# Altium schematic sheet MI.SchDoc
size A3
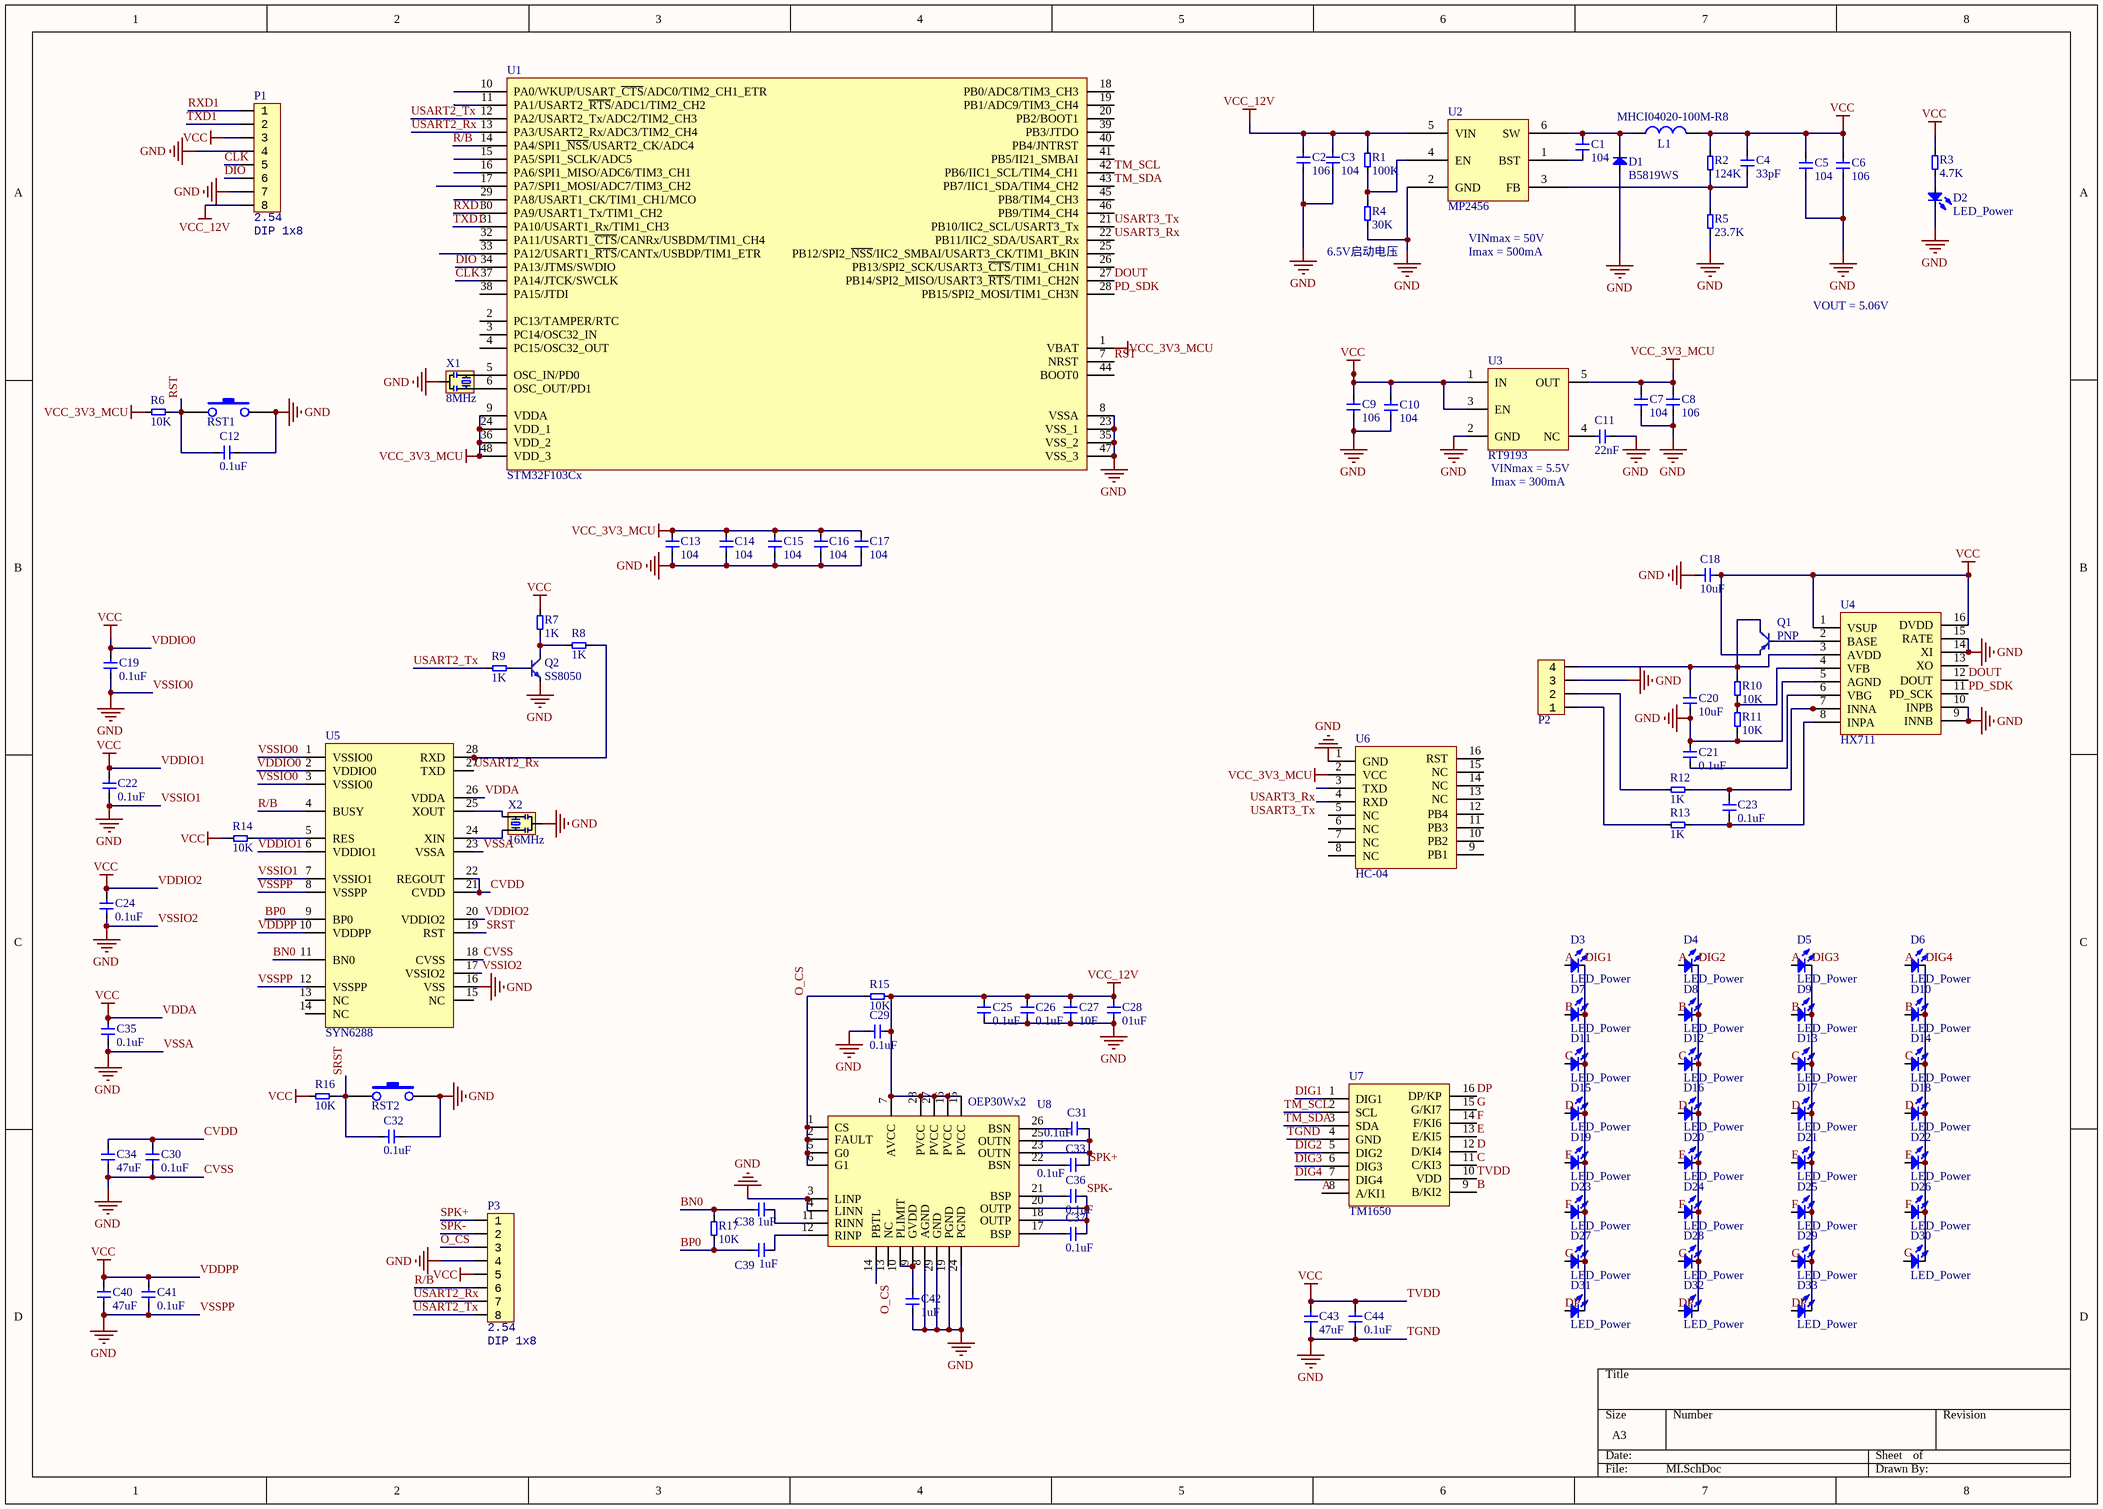
[diagram p0: MI.SchDoc]

## Parts
C1  104  [CAP-0603-L]
C2  106  [CAP-0603-L]
C3  104  [CAP-0603-L]
C4  33pF  [CAP-0603-L]
C5  104  [CAP-0603-L]
C6  106  [CAP-0603-L]
C7  104  [CAP-0603-L]
C8  106  [CAP-0603-L]
C9  106  [CAP-0603-L]
C10  104  [CAP-0603-L]
C11  22nF  [CAP-0603-L]
C12  0.1uF  [CAP-0603-L]
C13  104  [CAP-0603-L]
C14  104  [CAP-0603-L]
C15  104  [CAP-0603-L]
C16  104  [CAP-0603-L]
C17  104  [CAP-0603-L]
C18  10uF  [CAP-0603-L]
C19  0.1uF  [CAP-0603-L]
C20  10uF  [CAP-0603-L]
C21  0.1uF  [CAP-0603-L]
C22  0.1uF  [CAP-0603-L]
C23  0.1uF  [CAP-0603-L]
C24  0.1uF  [CAP-0603-L]
C25  0.1uF  [CAP-0603-L]
C26  0.1uF  [CAP-0603-L]
C27  10F  [CAP-0603-L]
C28  01uF  [CAP-0603-L]
C29  0.1uF  [CAP-0603-L]
C30  0.1uF  [CAP-0603-L]
C31  0.1uF  [CAP-0603-L]
C32  0.1uF  [CAP-0603-L]
C33  0.1uF  [CAP-0603-L]
C34  47uF  [CAP-0603-L]
C35  0.1uF  [CAP-0603-L]
C36  0.1uF  [CAP-0603-L]
C37  0.1uF  [CAP-0603-L]
C38  1uF  [CAP-0603-L]
C39  1uF  [CAP-0603-L]
C40  47uF  [CAP-0603-L]
C41  0.1uF  [CAP-0603-L]
C42  1uF  [CAP-0603-L]
C43  47uF  [CAP-0603-L]
C44  0.1uF  [CAP-0603-L]
D1  B5819WS  [SOD_323]
D2  LED_Power  [LED_0603-L]
D3  LED_Power  [LED_0603-L]
D4  LED_Power  [LED_0603-L]
D5  LED_Power  [LED_0603-L]
D6  LED_Power  [LED_0603-L]
D7  LED_Power  [LED_0603-L]
D8  LED_Power  [LED_0603-L]
D9  LED_Power  [LED_0603-L]
D10  LED_Power  [LED_0603-L]
D11  LED_Power  [LED_0603-L]
D12  LED_Power  [LED_0603-L]
D13  LED_Power  [LED_0603-L]
D14  LED_Power  [LED_0603-L]
D15  LED_Power  [LED_0603-L]
D16  LED_Power  [LED_0603-L]
D17  LED_Power  [LED_0603-L]
D18  LED_Power  [LED_0603-L]
D19  LED_Power  [LED_0603-L]
D20  LED_Power  [LED_0603-L]
D21  LED_Power  [LED_0603-L]
D22  LED_Power  [LED_0603-L]
D23  LED_Power  [LED_0603-L]
D24  LED_Power  [LED_0603-L]
D25  LED_Power  [LED_0603-L]
D26  LED_Power  [LED_0603-L]
D27  LED_Power  [LED_0603-L]
D28  LED_Power  [LED_0603-L]
D29  LED_Power  [LED_0603-L]
D30  LED_Power  [LED_0603-L]
D31  LED_Power  [LED_0603-L]
D32  LED_Power  [LED_0603-L]
D33  LED_Power  [LED_0603-L]
L1  MHCI04020-100M-R8  [L-0420]
P1  value 2.54  [HDR1X8_2.54_180]  (hidden comment: DIP 1x8)
P2  HDR1x4_2.54  [HDR1X4_2.54_180]  (value not drawn)
P3  value 2.54  [HDR1X8_2.54_180]  (hidden comment: DIP 1x8)
Q1  PNP  [SOT-23-3]
Q2  SS8050  [SOT-23-3]
R1  100K  [R-0603-L]
R2  124K  [R-0603-L]
R3  4.7K  [R-0603-L]
R4  30K  [R-0603-L]
R5  23.7K  [R-0603-L]
R6  10K  [R-0603-L]
R7  1K  [R-0603-L]
R8  1K  [R-0603-L]
R9  1K  [R-0603-L]
R10  10K  [R-0603-L]
R11  10K  [R-0603-L]
R12  1K  [R-0603-L]
R13  1K  [R-0603-L]
R14  10K  [R-0603-L]
R15  10K  [R-0603-L]
R16  10K  [R-0603-L]
R17  10K  [R-0603-L]
RST1  按键  [KEY_2S]  (value not drawn)
RST2  按键  [KEY_2S]  (value not drawn)
U1  STM32F103Cx  [LQFP_48]
U2  MP2456  [SOT-23-6]
U3  RT9193  [SOT-23-5]
U4  HX711  [SOP_E150_16]
U5  SYN6288  [SSOP28-26-209]
U6  HC-04  [HC-25]
U7  TM1650  [SOP_E150_16]
U8  OEP30Wx2  [TSSOP_E170_P0.65_28_PAD]
X1  8MHz  [XTAL-3213-3]
X2  16MHz  [XTAL-3213-3]

## Nets
CVSS: C2.1 C3.1 C5.1 C6.1 C7.2 C8.1 C9.1 C10.1 C11.2 C12.2 C13.2 C14.2 C15.2 C16.2 C17.2 C18.1 C19.2 C20.1 C21.2 C22.2 C24.2 C25.2 C26.2 C27.2 C28.2 C29.1 C30.2 C32.2 C34.2 C35.2 C40.2 C41.2 C42.1 C43.2 C44.2 D1.1 D2.2 P1.4 P1.7 P2.3 P3.4 Q2.2(E) R4.1 R5.1 R11.1 RST1.2 RST2.2 U1.8(VSSA) U1.23(VSS_1) U1.35(VSS_2) U1.47(VSS_3) U2.2(GND) U3.2(GND) U4.5(AGND) U4.9(INNB) U4.10(INPB) U4.14(XI) U4.15(RATE) U5.1(VSSIO0) U5.3(VSSIO0) U5.7(VSSIO1) U5.8(VSSPP) U5.12(VSSPP) U5.16(VSS) U5.17(VSSIO2) U5.18(CVSS) U5.23(VSSA) U6.1(GND) U7.4(GND) U8.3(LINP) U8.4(LINN) U8.8(AGND) U8.19(PGND) U8.24(PGND) U8.29(GND) X1.2(GND) X2.2(GND)  [also labelled GND, TGND, VSSA, VSSIO0, VSSIO1, VSSIO2, VSSPP]
TVDD: C4.2 C5.2 C6.2 C9.2 C10.2 C18.2 C19.1 C22.1 C24.1 C35.1 C40.1 C41.1 C43.1 C44.1 L1.2 P1.3 P3.5 Q1.2(E) R2.2 R3.2 R7.2 R14.1 R16.1 U3.1(IN) U3.3(EN) U4.1(VSUP) U4.16(DVDD) U5.2(VDDIO0) U5.6(VDDIO1) U5.10(VDDPP) U5.20(VDDIO2) U5.26(VDDA) U7.10(VDD)  [also labelled VCC, VDDA, VDDIO0, VDDIO1, VDDIO2, VDDPP]
VCC_3V3_MCU: C7.1 C8.2 C13.1 C14.1 C15.1 C16.1 C17.1 R6.1 U1.1(VBAT) U1.9(VDDA) U1.24(VDD_1) U1.36(VDD_2) U1.48(VDD_3) U3.5(OUT) U6.2(VCC)
VCC_12V: C2.2 C3.2 C25.1 C26.1 C27.1 C28.1 C29.2 P1.8 R1.2 R15.2 U2.5(VIN) U8.7(AVCC) U8.15(PVCC) U8.16(PVCC) U8.27(PVCC) U8.28(PVCC)
A: D3.1 D4.1 D5.1 D6.1 U7.8(A/KI1)
B: D7.1 D8.1 D9.1 D10.1 U7.9(B/KI2)
BN0: C38.2 R17.2 U5.11(BN0)
BP0: C39.2 R17.1 U5.9(BP0)
C: D11.1 D12.1 D13.1 D14.1 U7.11(C/KI3)
CLK: P1.5 U1.37(PA14/JTCK/SWCLK)
CVDD: C30.1 C34.1 U5.21(CVDD) U5.22(REGOUT)
D: D15.1 D16.1 D17.1 D18.1 U7.12(D/KI4)
DIG1: D3.2 D7.2 D11.2 D15.2 D19.2 D23.2 D27.2 D31.2 U7.1(DIG1)
DIG2: D4.2 D8.2 D12.2 D16.2 D20.2 D24.2 D28.2 D32.2 U7.5(DIG2)
DIG3: D5.2 D9.2 D13.2 D17.2 D21.2 D25.2 D29.2 D33.2 U7.6(DIG3)
DIG4: D6.2 D10.2 D14.2 D18.2 D22.2 D26.2 D30.2 U7.7(DIG4)
DIO: P1.6 U1.34(PA13/JTMS/SWDIO)
DOUT: U1.27(PB14/SPI2_MISO/USART3_~{RTS}/TIM1_CH2N) U4.12(DOUT)
DP: D31.1 D32.1 D33.1 U7.16(DP/KP)
E: D19.1 D20.1 D21.1 D22.1 U7.13(E/KI5)
F: D23.1 D24.1 D25.1 D26.1 U7.14(F/KI6)
G: D27.1 D28.1 D29.1 D30.1 U7.15(G/KI7)
O_CS: P3.3 R15.1 U8.1(CS) U8.2(FAULT) U8.5(G0) U8.6(G1) U8.14(PBTL)
PD_SDK: U1.28(PB15/SPI2_MOSI/TIM1_CH3N) U4.11(PD_SCK)
R/B: P3.6 U1.14(PA4/SPI1_~{NSS}/USART2_CK/ADC4) U5.4(BUSY)
RST: C12.1 R6.2 RST1.1 U1.7(NRST)
RXD1: P1.1 U1.30(PA9/USART1_Tx/TIM1_CH2)
SPK+: C31.2 C33.2 P3.1 U8.23(OUTN) U8.25(OUTN)
SPK-: C36.2 C37.2 P3.2 U8.18(OUTP) U8.20(OUTP)
SRST: C32.1 R16.2 RST2.1 U5.19(RST)
TM_SCL: U1.42(PB6/IIC1_SCL/TIM4_CH1) U7.2(SCL)
TM_SDA: U1.43(PB7/IIC1_SDA/TIM4_CH2) U7.3(SDA)
TXD1: P1.2 U1.31(PA10/USART1_Rx/TIM1_CH3)
USART2_Rx: P3.7 U1.13(PA3/USART2_Rx/ADC3/TIM2_CH4) U5.27(TXD)
USART2_Tx: P3.8 R9.2 U1.12(PA2/USART2_Tx/ADC2/TIM2_CH3)
USART3_Rx: U1.22(PB11/IIC2_SDA/USART_Rx) U6.3(TXD)
USART3_Tx: U1.21(PB10/IIC2_SCL/USART3_Tx) U6.4(RXD)
NetC1_1: C1.1 D1.2 L1.1 U2.6(SW)
NetC1_2: C1.2 U2.1(BST)
NetC4_1: C4.1 R2.1 R5.2 U2.3(FB)
NetC11_1: C11.1 U3.4(NC)
NetC20_2: C20.2 P2.4 Q1.3(C) R10.2 U4.3(AVDD)
NetC21_1: C21.1 U4.6(VBG)
NetC23_1: C23.1 R12.2 U4.7(INNA)
NetC23_2: C23.2 R13.2 U4.8(INPA)
NetC31_1: C31.1 U8.26(BSN)
NetC33_1: C33.1 U8.22(BSN)
NetC36_1: C36.1 U8.21(BSP)
NetC37_1: C37.1 U8.17(BSP)
NetC38_1: C38.1 U8.11(RINN)
NetC39_1: C39.1 U8.12(RINP)
NetC42_2: C42.2 U8.9(GVDD) U8.10(PLIMIT)
NetD2_1: D2.1 R3.1
NetP2_1: P2.1 R13.1
NetP2_2: P2.2 R12.1
NetQ1_1: Q1.1(B) U4.2(BASE)
NetQ2_1: Q2.1(B) R9.1
NetQ2_3: Q2.3(C) R7.1 R8.2
NetR1_1: R1.1 R4.2 U2.4(EN)
NetR8_1: R8.1 U5.28(RXD)
NetR10_1: R10.1 R11.2 U4.4(VFB)
NetR14_2: R14.2 U5.5(RES)
NetU1_5: U1.5(OSC_IN/PD0) X1.1(OSC1)
NetU1_6: U1.6(OSC_OUT/PD1) X1.3(OSC2)
NetU5_24: U5.24(XIN) X2.1(OSC1)
NetU5_25: U5.25(XOUT) X2.3(OSC2)

Not connected (* = marked no-connect by the designer): U1 2(PC13/TAMPER/RTC) 3(PC14/OSC32_IN) 4(PC15/OSC32_OUT) 10(PA0/WKUP/USART_~{CTS}/ADC0/TIM2_CH1_ETR) 11(PA1/USART2_~{RTS}/ADC1/TIM2_CH2) 15(PA5/SPI1_SCLK/ADC5) 16(PA6/SPI1_MISO/ADC6/TIM3_CH1) 17(PA7/SPI1_MOSI/ADC7/TIM3_CH2) 18(PB0/ADC8/TIM3_CH3) 19(PB1/ADC9/TIM3_CH4) 20(PB2/BOOT1) 25(PB12/SPI2_~{NSS}/IIC2_SMBAI/USART3_CK/TIM1_BKIN) 26(PB13/SPI2_SCK/USART3_~{CTS}/TIM1_CH1N) 29(PA8/USART1_CK/TIM1_CH1/MCO) 32(PA11/USART1_~{CTS}/CANRx/USBDM/TIM1_CH4) 33(PA12/USART1_~{RTS}/CANTx/USBDP/TIM1_ETR) 38(PA15/JTDI) 39(PB3/JTDO) 40(PB4/JNTRST) 41(PB5/II21_SMBAI) 44(BOOT0) 45(PB8/TIM4_CH3) 46(PB9/TIM4_CH4); U4 13(XO); U5 13(NC) 14(NC) 15(NC); U6 5(NC) 6(NC) 7(NC) 8(NC) 9(PB1) 10(PB2) 11(PB3) 12(PB4) 13(NC) 14(NC) 15(NC) 16(RST); U8 13(NC)

## Notes on the sheet
- (near U2) VINmax = 50V
- (near R4) 6.5V启动电压
- Imax = 500mA
- VOUT = 5.06V
- Imax = 300mA
- VINmax = 5.5V

## Library data of the parts
C1-C44 = CAP
D1 = Diode
D2-D33 = LED
L1 = Inductor: 电感
P1 P3 = HDR1x8_2.54: Header; Type: DIP 1x8
P2 = HDR1x4_2.54: Header
Q1 = BJT_PNP: Transistor
Q2 = BJT_NPN: Transistor
R1-R17 = Res
U2 = MP2451
U3 = LP5907MFX
X1 X2 = XTAL-3215-3